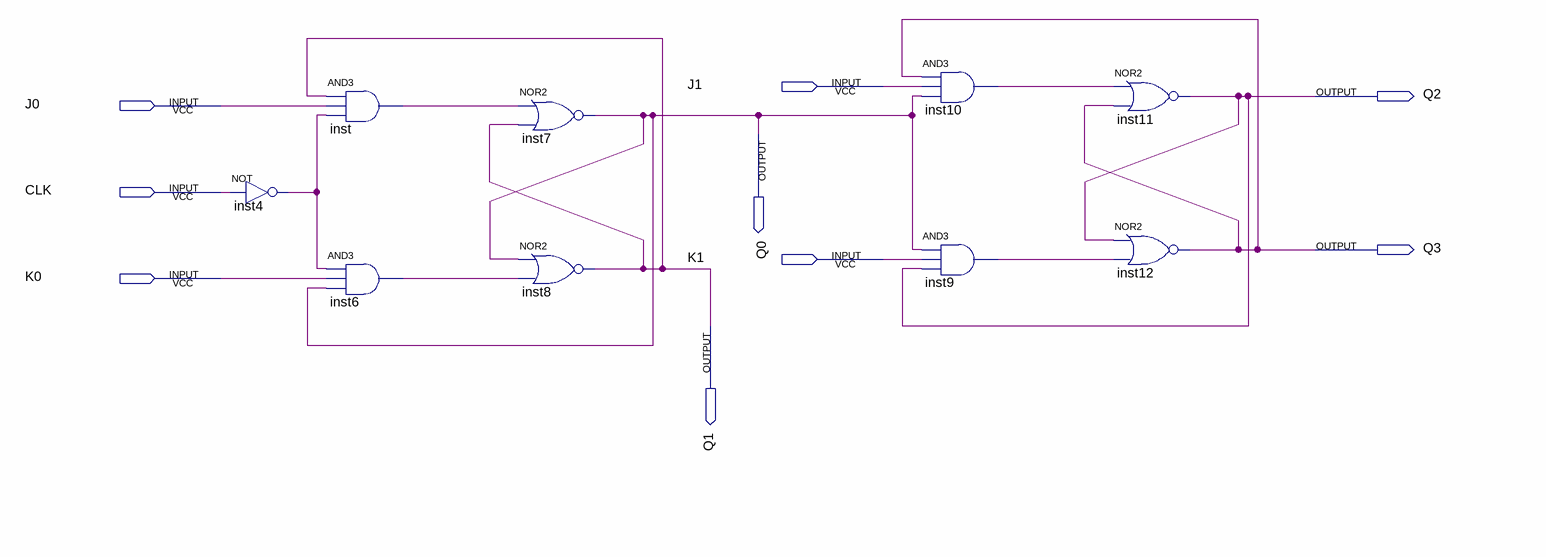
[diagram p0: schematic sheet]
// Quartus schematic flipflopJK_negedge.bdf as structural Verilog: 9 symbols, 9 pins
module flipflopJK_negedge (
  input  J1,
  input  J0,
  input  CLK,
  input  K1,
  input  K0,
  output Q2,
  output Q0,
  output Q3,
  output Q1
);

  wire inst4_out, inst6_out, inst9_out, inst10_out, inst_out;

  not inst4 (inst4_out, CLK);
  and inst (inst_out, Q1, J0, inst4_out);
  and inst6 (inst6_out, inst4_out, K0, Q0);
  nor inst7 (Q0, inst_out, Q1);
  nor inst8 (Q1, Q0, inst6_out);
  and inst10 (inst10_out, Q3, J1, Q0);
  and inst9 (inst9_out, Q0, K1, Q2);
  nor inst11 (Q2, inst10_out, Q3);
  nor inst12 (Q3, Q2, inst9_out);
endmodule
